# Altium schematic sheet УШЯИ.411618.029Э Э3 Лист 7.schdoc (part 1 of 3)
size 594 x 420 mm; SheetNumber: 7; SheetTotal: 8
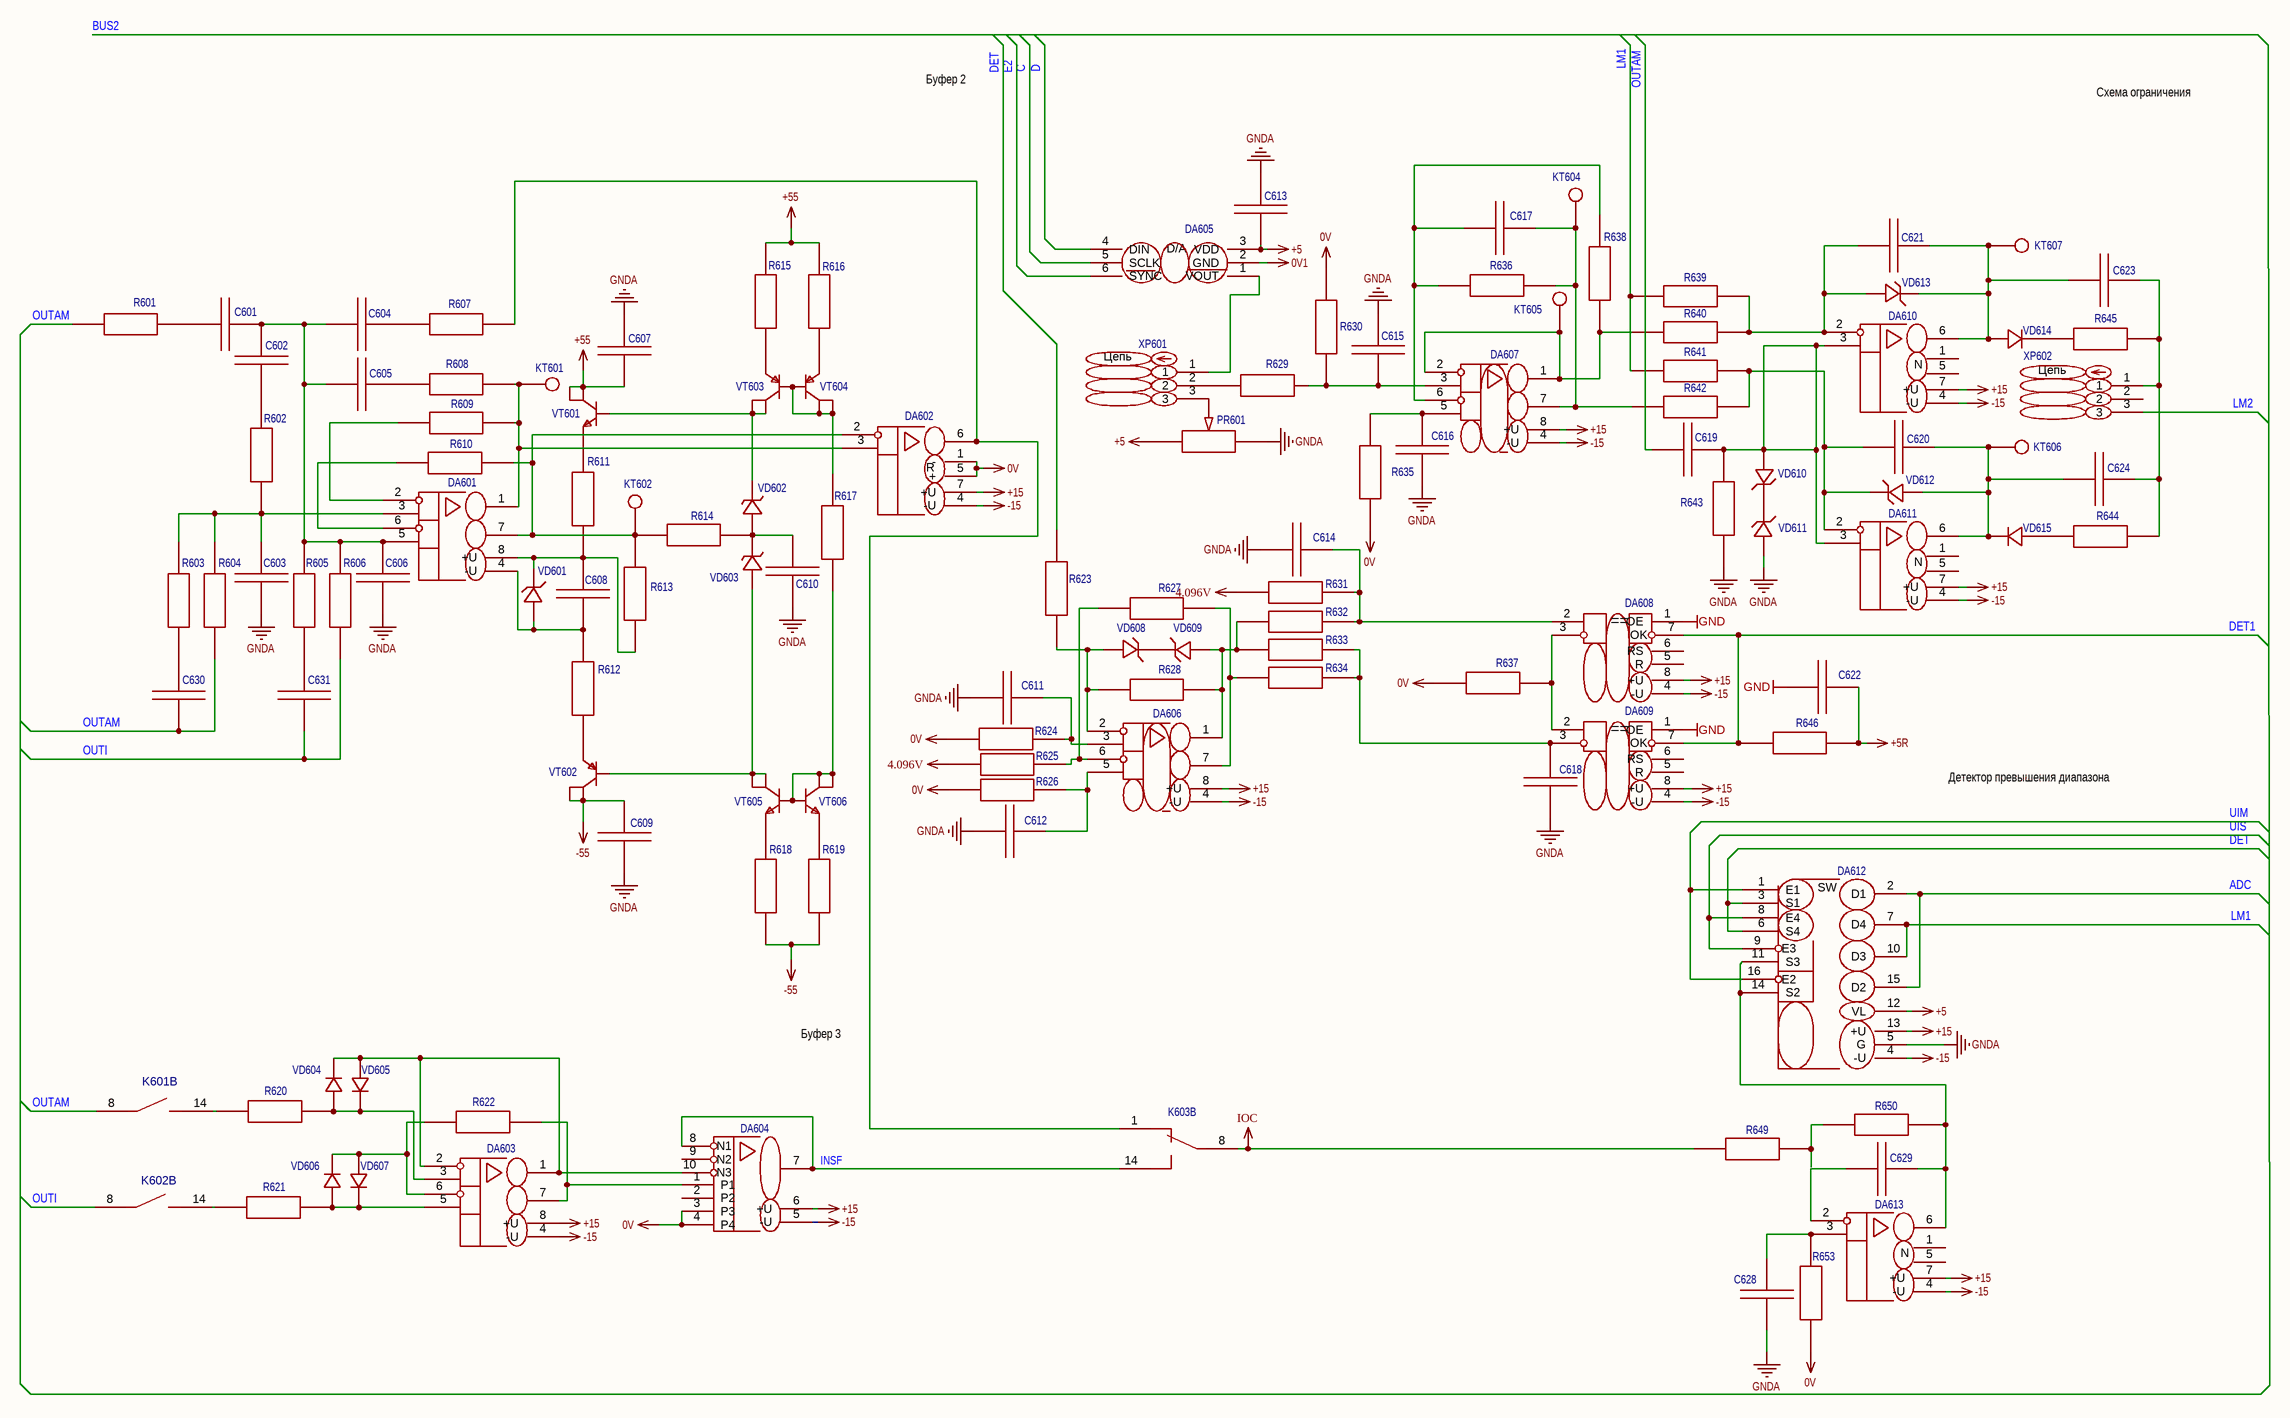
[diagram p0: УШЯИ.411618.029Э Э3 Лист 7.schdoc]

## Parts
C601  Конденсатор К10-17Б М47 6,8пФ  NP0 5% [DIP]  [Конденсатор К10-17Б М47 X.X.xФ  NP0 5% [DIP 5мм]]  (value not drawn)
C602  Конденсатор К10-17Б М47 10пФ  NP0 5% [DIP]  [Конденсатор К10-17Б М47 X.X.xФ  NP0 5% [DIP 5мм]]  (value not drawn)
C603  Конденсатор SMD 15пФ 100В X7R 10% [0805]  [C0805]  (value not drawn)
C604  Конденсатор К10-17Б М47 10пФ  NP0 5% [DIP]  [Конденсатор К10-17Б М47 X.X.xФ  NP0 5% [DIP 5мм]]  (value not drawn)
C605  Конденсатор К10-17Б М47 10пФ  NP0 5% [DIP]  [Конденсатор К10-17Б М47 X.X.xФ  NP0 5% [DIP 5мм]]  (value not drawn)
C606  Конденсатор К10-17Б М47 15пФ  NP0 5% [DIP]  [Конденсатор К10-17Б М47 X.X.xФ  NP0 5% [DIP 5мм]]  (value not drawn)
C607  Конденсатор SMD 0,068мкФ 100В X7R 10% [0805]  [C0805]  (value not drawn)
C608  Конденсатор SMD 5600пФ 100В X7R 10% [0805]  [C0805]  (value not drawn)
C609  Конденсатор SMD 0,068мкФ 100В X7R 10% [0805]  [C0805]  (value not drawn)
C610  Конденсатор SMD 100пФ 100В X7R 10% [0805]  [C0805]  (value not drawn)
C611  Конденсатор SMD 9100пФ 100В X7R 10% [1206]  [C0805]  (value not drawn)
C612  Конденсатор SMD 9100пФ 100В X7R 10% [1206]  [C0805]  (value not drawn)
C613  Конденсатор SMD 0,33мкФ 100В X7R 10% [0805]  [C0805]  (value not drawn)
C614  Конденсатор SMD 0,33мкФ 100В X7R 10% [0805]  [C0805]  (value not drawn)
C615  Конденсатор SMD 9100пФ 100В X7R 10% [0805]  [C0805]  (value not drawn)
C616  Конденсатор SMD 9100пФ 100В X7R 10% [0805]  [C0805]  (value not drawn)
C617  Конденсатор SMD 33пФ 100В X7R 10% [0805]  [C0805]  (value not drawn)
C618  Конденсатор SMD 9100пФ 100В X7R 10% [1206]  [C1206]  (value not drawn)
C619  Конденсатор SMD 9100пФ 100В X7R 10% [1206]  [C1206]  (value not drawn)
C620  Конденсатор SMD 680пФ 100В X7R 10% [0805]  [C0805]  (value not drawn)
C621  Конденсатор SMD 680пФ 100В X7R 10% [0805]  [C0805]  (value not drawn)
C622  Конденсатор SMD 0,33мкФ 100В X7R 10% [0805]  [C0805]  (value not drawn)
C623  Конденсатор SMD 100нФ В X7R 10% [0805]  [C0805]  (value not drawn)
C624  Конденсатор SMD 100нФ В X7R 10% [0805]  [C0805]  (value not drawn)
C628  Конденсатор SMD 51пФ 100В X7R 10% [0805]  [C0805]  (value not drawn)
C629  Конденсатор SMD 33пФ 100В X7R 10% [0805]  [C0805]  (value not drawn)
C630  Конденсатор SMD 22пФ 100В X7R 10% [0805]  [C0805]  (value not drawn)
C631  Конденсатор SMD 10пФ 100В X7R 10% [0805]  [C0805]  (value not drawn)
DA601  Операционный усилитель TLV9152IDR [SOIC-8]  [SOIC-8_L4.9-W3.9-P1.27-LS6.0-BL]  (value not drawn)
DA602  Операционный усилитель AD629BN [DIP-8]  [PDIP-8_L9.6-W6.4-P2.54-LS7.6-BL-1]  (value not drawn)
DA603  Операционный усилитель AD8512ARZ [SOIC-8]  [SOIC-8_L4.9-W3.9-P1.27-LS6.0-BL]  (value not drawn)
DA604  Операционный усилитель AD8271 [MSOP-10]  [MSOP-10_L3.0-W3.0-P0.50-LS5.0-BL]  (value not drawn)
DA605  Цифроаналоговый преобразователь AD5300BRTZ [SOT-23-6]  [SOT-23-6_L2.9-W1.6-P0.95-LS2.8-BL]  (value not drawn)
DA606  Операционный усилитель AD8672ARZ [SOIC-8]  [SOIC-8_L4.9-W3.9-P1.27-LS6.0-BL]  (value not drawn)
DA607  Операционный усилитель AD8672ARZ [SOIC-8]  [SOIC-8_L4.9-W3.9-P1.27-LS6.0-BL]  (value not drawn)
DA608  Компаратор КР554СА3А [DIP-8]  [DIP-8_L9.7-W6.4-P2.54-LS7.6-BL-1]  (value not drawn)
DA609  Компаратор КР554СА3А [DIP-8]  [DIP-8_L9.7-W6.4-P2.54-LS7.6-BL-1]  (value not drawn)
DA610  Операционный усилитель ADA4627-1BRZ [SOIC-8]  [SOIC-8_L5.0-W4.0-P1.27-LS6.1-BL]  (value not drawn)
DA611  Операционный усилитель ADA4627-1BRZ [SOIC-8]  [SOIC-8_L5.0-W4.0-P1.27-LS6.1-BL]  (value not drawn)
DA612  Коммутатор аналоговых сигналов ADG433BRZ [SOIC-16]  [SOIC-16_L9.9-W3.9-P1.27-LS6.0-BL]  (value not drawn)
DA613  Операционный усилитель ADA4627-1BRZ [SOIC-8]  [SOIC-8_L5.0-W4.0-P1.27-LS6.1-BL]  (value not drawn)
K601  Реле герконовое DIP05-1A72-13L  [PCB]  [Реле герконовое DIP05-1A72-13L  [PCB]]  (value not drawn)  (part B of 2)
K602  Реле герконовое DIP05-1A72-13L  [PCB]  [Реле герконовое DIP05-1A72-13L  [PCB]]  (value not drawn)  (part B of 2)
K603  Реле герконовое DIP05-1C90-51L [PCB]  [Реле герконовое DIP05-1C90-51L [PCB]]  (value not drawn)  (part B of 2)
KT601  Control point  (value not drawn)
KT602  Control point  (value not drawn)
KT604  Control point  (value not drawn)
KT605  Control point  (value not drawn)
KT606  Control point  (value not drawn)
KT607  Control point  (value not drawn)
PR601  47кОм  [RES-ADJ-TH_3329H]  (value not drawn)
R601  Резистор 51кОм 0,125Вт 1% [0805]  [R0805]  (value not drawn)
R602  Резистор 12кОм 0,125Вт 1% [0805]  [R0805]  (value not drawn)
R603  Резистор 5,1кОм 0,125Вт 1% [0805]  [R0805]  (value not drawn)
R604  Резистор 301кОм 0.25Вт 1% [1206]  [R1206]  (value not drawn)
R605  Резистор C2-29В-0,125 5,1кОм 0,125Вт 1% [DIP]  [Резистор C2-29В-0,125 X.XxОм 0,125Вт 1% [DIP]]  (value not drawn)
R606  Резистор C2-29В-0,125 301кОм 0,125Вт 1% [DIP]  [Резистор C2-29В-0,125 X.XxОм 0,125Вт 1% [DIP]]  (value not drawn)
R607  Резистор 51кОм 0,125Вт 1% [0805]  [R0805]  (value not drawn)
R608  Резистор 12кОм 0,125Вт 1% [0805]  [R0805]  (value not drawn)
R609  Резистор 33Ом 0,125Вт 1% [0805]  [R0805]  (value not drawn)
R610  Резистор 33Ом 0,125Вт 1% [0805]  [R0805]  (value not drawn)
R611  Резистор 150Ом 0,25Вт 1% [1206]  [R1206]  (value not drawn)
R612  Резистор 150Ом 0,25Вт 1% [1206]  [R1206]  (value not drawn)
R613  Резистор 5,1кОм 0,125Вт 1% [0805]  [R0805]  (value not drawn)
R614  Резистор 4,7кОм 0,25Вт 1% [1206]  [R1206]  (value not drawn)
R615  Резистор 820Ом 0,125Вт 1% [0805]  [R0805]  (value not drawn)
R616  Резистор 2кОм 0,125Вт 1% [0805]  [R0805]  (value not drawn)
R617  Резистор 200кОм 0,125Вт 1% [0805]  [R0805]  (value not drawn)
R618  Резистор 820Ом 0,125Вт 1% [0805]  [R0805]  (value not drawn)
R619  Резистор 2кОм 0,125Вт 1% [0805]  [R0805]  (value not drawn)
R620  Резистор 300Ом 0,125Вт 1% [0805]  [R0805]  (value not drawn)
R621  Резистор 300Ом 0,125Вт 1% [0805]  [R0805]  (value not drawn)
R622  Резистор 300Ом 0,125Вт 1% [0805]  [R0805]  (value not drawn)
R623  Резистор 10кОм 0.25Вт 1% [1206]  [R1206]  (value not drawn)
R624  Резистор 10кОм 0.25Вт 1% [1206]  [R1206]  (value not drawn)
R625  Резистор 10кОм 0.25Вт 1% [1206]  [R1206]  (value not drawn)
R626  Резистор 10кОм 0.25Вт 1% [1206]  [R1206]  (value not drawn)
R627  Резистор 10кОм 0,125Вт 1% [0805]  [R0805]  (value not drawn)
R628  Резистор 10кОм 0,125Вт 1% [0805]  [R0805]  (value not drawn)
R629  Резистор 470Ом 0,125Вт 1% [0805]  [R0805]  (value not drawn)
R630  Резистор 12кОм 0,125Вт 1% [0805]  [R0805]  (value not drawn)
R631  Резистор 10кОм 0.25Вт 1% [1206]  [R1206]  (value not drawn)
R632  Резистор 17,2кОм 0.25Вт 1% [1206]  [R1206]  (value not drawn)
R633  Резистор 17,2кОм 0.25Вт 1% [1206]  [R1206]  (value not drawn)
R634  Резистор 10кОм 0.25Вт 1% [1206]  [R1206]  (value not drawn)
R635  Резистор 12кОм 0,125Вт 1% [0805]  [R0805]  (value not drawn)
R636  Резистор 10кОм 0.25Вт 1% [0805]  [R0805]  (value not drawn)
R637  Резистор 5,1кОм 0,125Вт 1% [0805]  [R0805]  (value not drawn)
R638  Резистор 10кОм 0.25Вт 1% [1206]  [R1206]  (value not drawn)
R639  Резистор 4,99кОм 0.25Вт 1% [1206]  [R1206]  (value not drawn)
R640  Резистор 10кОм 0.25Вт 1% [1206]  [R1206]  (value not drawn)
R641  Резистор 4,99кОм 0.25Вт 1% [1206]  [R1206]  (value not drawn)
R642  Резистор 10кОм 0.25Вт 1% [1206]  [R1206]  (value not drawn)
R643  Резистор 24кОм 0,125Вт 1% [0805]  [R0805]  (value not drawn)
R644  Резистор 4,7кОм 0,125Вт 1% [0805]  [R0805]  (value not drawn)
R645  Резистор 4,7кОм 0,125Вт 1% [0805]  [R0805]  (value not drawn)
R646  Резистор 12кОм 0,125Вт 1% [0805]  [R0805]  (value not drawn)
R649  Резистор 2кОм 0.25Вт 1% [1206]  [R1206]  (value not drawn)
R650  Резистор 2кОм 0.25Вт 1% [1206]  [R1206]  (value not drawn)
R653  Резистор 3,3кОм 0,125Вт 1% [0805]  [R0805]  (value not drawn)
VD601  Стабилитрон MMSZ5230B 4.7В 0.5Вт [SOD123]  [SOD-123_L2.8-W1.8-LS3.7-RD]  (value not drawn)
VD602  Стабилитрон MMSZ5232B 5.6В 0.5Вт [SOD123]  [SOD-123_L2.7-W1.6-LS3.7-RD]  (value not drawn)
VD603  Стабилитрон MMSZ5232B 5.6В 0.5Вт [SOD123]  [SOD-123_L2.7-W1.6-LS3.7-RD]  (value not drawn)
VD604  Диод JPAD50 [SOT-23]  [SOT-23-3_L3.0-W1.6-P1.90-LS2.8-L]  (value not drawn)
VD605  Диод JPAD50 [SOT-23]  [SOT-23-3_L3.0-W1.6-P1.90-LS2.8-L]  (value not drawn)
VD606  Диод JPAD50 [SOT-23]  [SOT-23-3_L3.0-W1.6-P1.90-LS2.8-L]  (value not drawn)
VD607  Диод JPAD50 [SOT-23]  [SOT-23-3_L3.0-W1.6-P1.90-LS2.8-L]  (value not drawn)
VD608  Стабилитрон MMSZ5223B 2.7В 0.5Вт [SOD123]  [SOD-123_L2.8-W1.8-LS3.7-RD]  (value not drawn)
VD609  Стабилитрон MMSZ5223B 2.7В 0.5Вт [SOD123]  [SOD-123_L2.8-W1.8-LS3.7-RD]  (value not drawn)
VD610  Стабилитрон MMSZ5234B 6.2В 0.5Вт [SOD123]  [SOD-123_L2.8-W1.8-LS3.7-RD]  (value not drawn)
VD611  Стабилитрон MMSZ5234B 6.2В 0.5Вт [SOD123]  [SOD-123_L2.8-W1.8-LS3.7-RD]  (value not drawn)
VD612  Стабилитрон MMSZ5234B 6.2В 0.5Вт [SOD123]  [SOD-123_L2.8-W1.8-LS3.7-RD]  (value not drawn)
VD613  Стабилитрон MMSZ5234B 6.2В 0.5Вт [SOD123]  [SOD-123_L2.8-W1.8-LS3.7-RD]  (value not drawn)
VD614  Диод импульсный 1N4448 [SOD-123]  [SOD-123_L2.7-W1.6-LS3.7-RD-1]  (value not drawn)
VD615  Диод импульсный 1N4448 [SOD-123]  [SOD-123_L2.7-W1.6-LS3.7-RD-1]  (value not drawn)
VT601  Транзистор DZTA42 NPN [SOT223]  [SOT-223-4_L6.5-W3.5-P2.30-LS7.0-BR]  (value not drawn)
VT602  Транзистор DZTA92 PNP [SOT223]  [SOT-223-3_L6.5-W3.4-P2.30-LS7.0-BR]  (value not drawn)
VT603  Транзистор DZTA92 PNP [SOT223]  [SOT-223-3_L6.5-W3.4-P2.30-LS7.0-BR]  (value not drawn)
VT604  Транзистор DZTA92 PNP [SOT223]  [SOT-223-3_L6.5-W3.4-P2.30-LS7.0-BR]  (value not drawn)
VT605  Транзистор DZTA42 NPN [SOT223]  [SOT-223-4_L6.5-W3.5-P2.30-LS7.0-BR]  (value not drawn)
VT606  Транзистор DZTA42 NPN [SOT223]  [SOT-223-4_L6.5-W3.5-P2.30-LS7.0-BR]  (value not drawn)
XP601  Вилка на плату 826629-3 шаг 2.54мм  [HDR-TH_3P-P2.54-V-M-1]  (value not drawn)
XP602  Вилка на плату 826629-3 шаг 2.54мм  [HDR-TH_3P-P2.54-V-M-1]  (value not drawn)

## Nets
0V: DA602.1(-) DA602.5(+) DA604.3(P3) DA604.4(P4) R624.1 R626.1 R630.2 R635.2 R637.2 R653.1
0V1: DA605.2(GND)
4.096V: R625.1 R631.1
+5: C613.1 DA605.3(VDD) DA612.12(VL) PR601.3
+5R: C622.2 R646.2
+15: DA602.7(+U) DA603.8(+U) DA604.6(+U) DA606.8(+U) DA607.8(+U) DA608.8(+U) DA609.8(+U) DA610.7(+U) DA611.7(+U) DA612.13(+U) DA613.7(+U)
+55: C607.1 R615.2 R616.2 VT601.2(C) VT601.4(C)
-15: DA602.4(-U) DA603.4(-U) DA604.5(-U) DA606.4(-U) DA607.4(-U) DA608.4(-U) DA609.4(-U) DA610.4(-U) DA611.4(-U) DA612.4(-U) DA613.4(-U)
-55: C609.1 R618.1 R619.1 VT602.2(C) VT602.4(C)
GND: C622.1 DA608.1(OE) DA609.1(OE)
GNDA: C603.2 C606.2 C607.2 C609.2 C610.1 C611.1 C612.1 C613.2 C614.1 C615.2 C616.2 C618.1 C628.2 DA612.5(G) PR601.1 R643.2 VD611.2(A)
IOC: K603.8 R649.2
ADC: DA612.2(D1) DA612.15(D2)
DET: R623.1
DET1: DA608.7(OK) DA609.7(OK) R646.1
INSF: DA604.7(OUT) DA604.8(N1) K603.14
LM1: DA612.7(D4) DA612.10(D3) R639.1 R641.1
LM2: XP602.3
OUTAM: C619.1 C630.1 K601.8 R601.2 R604.1
OUTI: C631.1 K602.8 R606.1
NetC601_1: C601.1 R601.1
NetC601_2: C601.2 C602.2 C604.2 C605.2 C606.1 DA601.5(+IN) R605.2 R606.2
NetC602_1: C602.1 R602.1
NetC603_1: C603.1 DA601.3(+IN) R602.2 R603.2 R604.2
NetC604_1: C604.1 R607.1
NetC605_1: C605.1 R608.1
NetC608_1: C608.1 DA601.4(-U) R612.2 VD601.2(A)
NetC608_2: C608.2 DA601.8(+U) R611.1 R613.2 VD601.1(K)
NetC610_2: C610.2 R614.2 VD602.2(A) VD603.1(K)
NetC611_2: C611.2 DA606.3(+IN) R624.2
NetC612_2: C612.2 DA606.5(+IN) R626.2
NetC614_2: C614.2 DA608.2 R631.2 R632.2
NetC615_1: C615.1 DA607.3(+IN) R629.2 R630.1
NetC616_1: C616.1 DA607.5(+IN) R635.1
NetC617_1: C617.1 DA607.7(OUT) KT604.1 R636.1 R642.1
NetC617_2: C617.2 DA607.6(-IN) R636.2 R638.2
NetC618_2: C618.2 DA609.3 R633.2 R634.2
NetC619_2: C619.2 DA610.3(+IN) DA611.3(+IN) R643.1 VD610.2(A)
NetC620_1: C620.1 DA611.2(-IN) R641.2 R642.2 VD612.1(K)
NetC620_2: C620.2 C624.2 DA611.6(OUT) KT606.1 VD612.2(A) VD615.1(C)
NetC621_1: C621.1 DA610.2(-IN) R639.2 R640.2 VD613.2(A)
NetC621_2: C621.2 C623.2 DA610.6(OUT) KT607.1 VD613.1(K) VD614.2(A)
NetC623_1: C623.1 C624.1 R644.1 R645.1 XP602.1
NetC628_1: C628.1 DA613.3(+IN) R653.2
NetC629_1: C629.1 DA613.2(-IN)
NetC629_2: C629.2 DA612.11(S3) DA612.14(S2) DA613.6(OUT) R650.1
NetC630_2: C630.2 R603.1
NetC631_2: C631.2 R605.1
NetDA601_1: DA601.1(OUT) DA602.3(+IN) KT601.1 R608.2 R609.2
NetDA601_2: DA601.2(-IN) R609.1
NetDA601_6: DA601.6(-IN) R610.1
NetDA601_7: DA601.7(OUT) DA602.2(-IN) KT602.1 R610.2 R613.1 R614.1
NetDA602_6: DA602.6(OUT) K603.1 R607.2
NetDA603_1: DA603.1(OUT) DA603.2(-IN) DA604.10(N3) VD604.3 VD605.1
NetDA603_3: DA603.3(+IN) R620.2 VD604.1 VD605.3
NetDA603_5: DA603.5(+IN) R621.2 VD606.1 VD607.3
NetDA603_6: DA603.6(-IN) R622.1 VD606.3 VD607.1
NetDA603_7: DA603.7(OUT) DA604.1(P1) R622.2
NetDA605_1: DA605.1(VOUT) XP601.1
NetDA606_1: DA606.1(OUT) R628.2 R632.1 R633.1 VD609.2(A)
NetDA606_2: DA606.2(-IN) R623.2 R628.1 VD608.2(A)
NetDA606_6: DA606.6(-IN) R625.2 R627.1
NetDA606_7: DA606.7(OUT) R627.2 R634.1
NetDA607_1: DA607.1(OUT) DA607.2(-IN) KT605.1 R638.1 R640.1
NetDA608_3: DA608.3 DA609.2 R637.1
NetDA612_1: DA612.1(E1) DA612.16(E2)
NetDA612_3: DA612.3(S1) DA612.6(S4)
NetDA612_8: DA612.8(E4) DA612.9(E3)
NetK601_14: K601.14 R620.1
NetK602_14: K602.14 R621.1
NetPR601_2: PR601.2 XP601.3
NetR611_2: R611.2 VT601.3(E)
NetR612_1: R612.1 VT602.3(E)
NetR615_1: R615.1 VT603.3(E)
NetR616_1: R616.1 VT604.3(E)
NetR617_1: R617.1 VT605.1(B) VT606.1(B) VT606.2(C) VT606.4(C)
NetR617_2: R617.2 VT603.1(B) VT604.1(B) VT604.2(C) VT604.4(C)
NetR618_2: R618.2 VT605.3(E)
NetR619_2: R619.2 VT606.3(E)
NetR629_1: R629.1 XP601.2
NetR644_2: R644.2 VD615.2(A)
NetR645_2: R645.2 VD614.1(C)
NetR649_1: R649.1 R650.2
NetVD602_1: VD602.1(K) VT601.1(B) VT603.2(C) VT603.4(C)
NetVD603_2: VD603.2(A) VT602.1(B) VT605.2(C) VT605.4(C)
NetVD608_1: VD608.1(K) VD609.1(K)
NetVD610_1: VD610.1(K) VD611.1(K)

Not connected (* = marked no-connect by the designer): DA604 2(P2) 9(N2); DA605 4(DIN) 5(SCLK) 6(SYNC); DA608 5(R) 6(RS); DA609 5(R) 6(RS); DA610 1(N) 5(N); DA611 1(N) 5(N); DA613 1(N) 5(N); XP602 2

## Buses and harness runs
bus BUS2

## Notes on the sheet
- Буфер 2
- Схема ограничения
- Детектор превышения диапазона
- Буфер 3
- Подп. и дата
- Инв.№ дубл.
- Взам.инв.№
- Подп.и дата
- Инв.№ подл.
- Изм.
- Лист
- № докум.
- Подп.
- Дата
- Формат  A2
- (in symbol Вилка на плату 826629-3 шаг 2.54мм) Цепь
- (in symbol Коммутатор аналоговых сигналов ADG433BRZ [SOIC-16]) SW
- (in symbol Операционный усилитель AD629BN [DIP-8]) R
- (in symbol Цифроаналоговый преобразователь AD5300BRTZ [SOT-23-6]) D/A